# Altium schematic sheet usb2TTL_ch340g.SchDoc
size A4
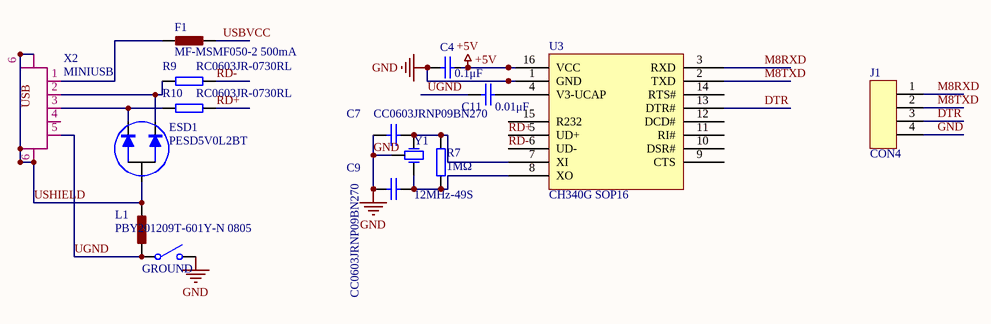
[diagram p0: usb2TTL_ch340g.SchDoc]

## Parts
C4  0.1μF  [0603C]
C7  CC0603JRNP09BN270  [0603C]
C9  CC0603JRNP09BN270  [0603C]
C11  0.01μF  [0603C]
ESD1  PESD5V0L2BT  [SOT-23]
F1  MF-MSMF050-2 500mA  [L1206]
GROUND  (no value)  [0101]
J1  CON4
L1  PBY201209T-601Y-N 0805  [L0805]
R7  1MΩ  [0603R]
R9  RC0603JR-0730RL  [0603R]
R10  RC0603JR-0730RL  [0603R]
U3  CH340G SOP16  [SO-16]
X2  MINIUSB  [USB-MINI3]
Y1  12MHz-49S  [XTAL-49S]

## Nets
+5V: C4.2 U3.16(VCC)
GND: C4.1 C7.1 C9.1 GROUND.2(NO) J1.4 U3.1(GND) Y1.3
DTR: J1.3 U3.13(DTR#)
M8RXD: J1.1 U3.3(RXD)
M8TXD: J1.2 U3.2(TXD)
RD+: R10.1 U3.5(UD+)
RD-: R9.1 U3.6(UD-)
UGND: C11.2 GROUND.1(COMMON) L1.2 X2.5
USBVCC: F1.1
USHIELD: ESD1.3 L1.1 X2.6 X2.?1 X2.?2
NetC7_2: C7.2 R7.1 U3.7(XI) Y1.1(OSC1)
NetC9_2: C9.2 R7.2 U3.8(XO) Y1.2(OSC2)
NetC11_1: C11.1 U3.4(V3-UCAP)
NetESD1_1: ESD1.1 R10.2 X2.3
NetESD1_2: ESD1.2 R9.2 X2.2
NetF1_2: F1.2 X2.1

Not connected (* = marked no-connect by the designer): U3 9(CTS) 10(DSR#) 11(RI#) 12(DCD#) 14(RTS#) 15(R232); X2 4

## Library data of the parts
C4 C7 C9 C11 = Cap: Capacitor; Published: 8-Jun-2000; LatestRevisionDate: 17-Jul-2002; LatestRevisionNote: Re-released for DXP Platform.; PackageReference: RAD-0.3; Publisher: Altium Limited; PackageDescription: Radial Cap, Thru-Hole; 2 Leads; 0.3 in Pin Spacing
ESD1 = ESD1
F1 L1 = L: BLM21
GROUND = SW-SPST: Single-Pole, Single-Throw Switch; Published: 24-Mar-1999; LatestRevisionDate: 17-Jul-2002; LatestRevisionNote: Re-released for DXP Platform.; PackageReference: SPST-2; Publisher: Altium Limited; PackageDescription: Switch; 2 Leads
J1 = CON4: SOCKET
R7 R9 R10 = R: Resistor
U3 = CH340G
X2 = USB-B_MINI: USB
Y1 = XTAL1: 3pXTAL